# Altium schematic sheet WIRELESS_UART.SchDoc
size A4
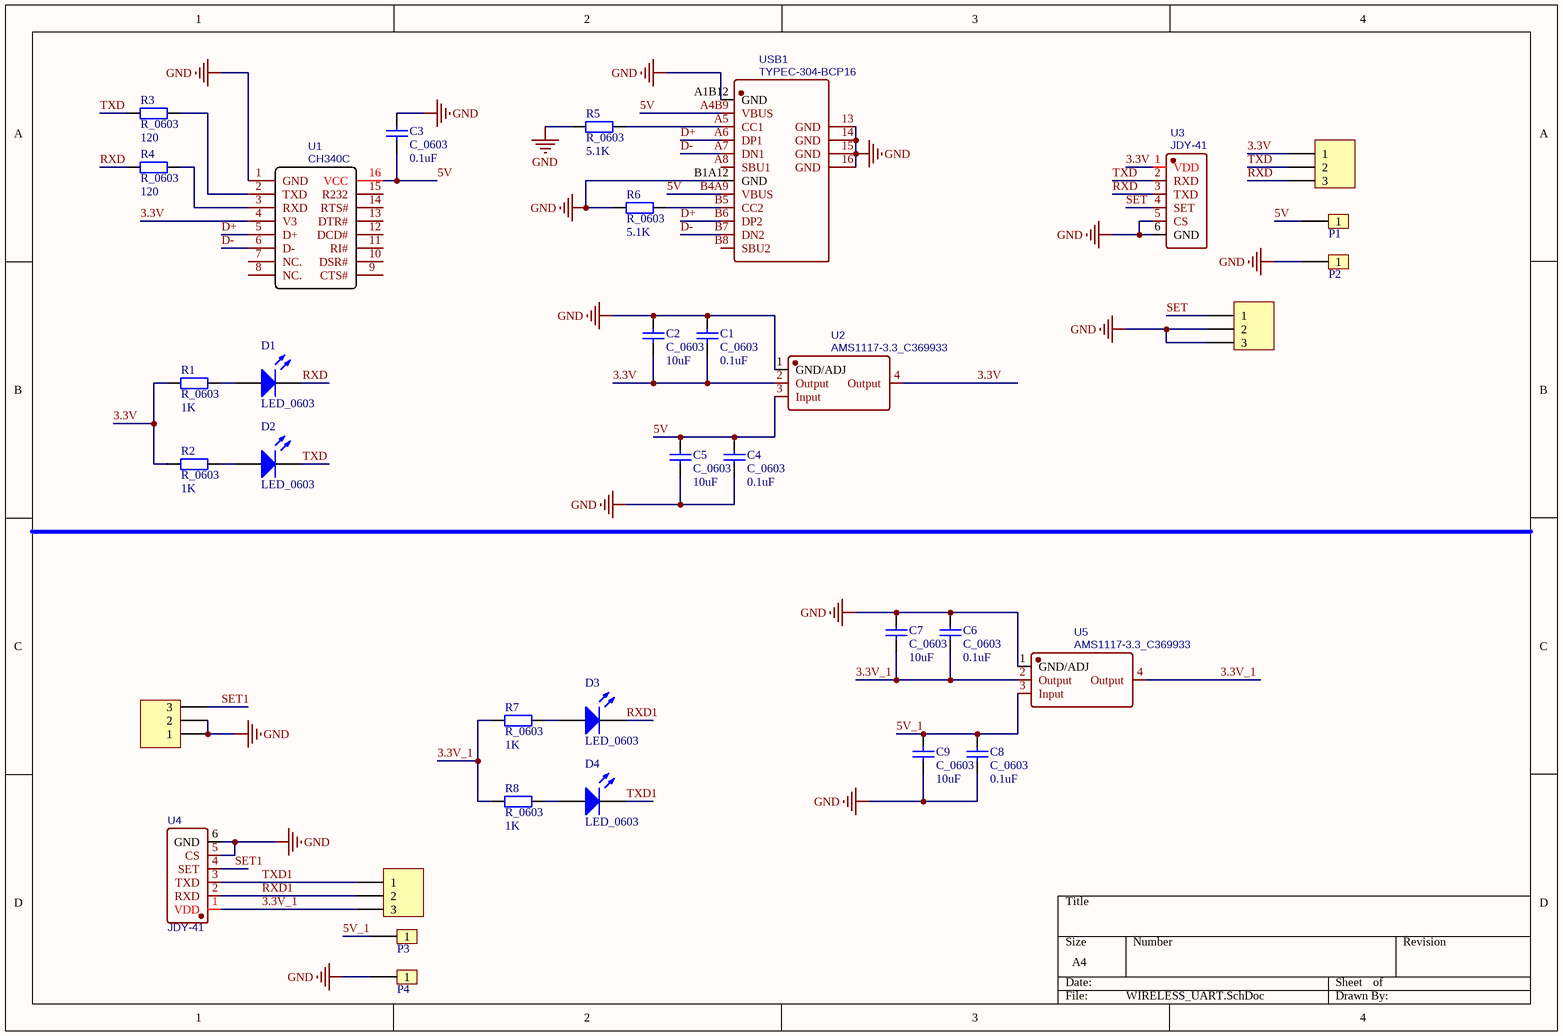
[diagram p0: WIRELESS_UART.SchDoc]

## Parts
C1  C_0603  value 0.1uF  [C_0603]
C2  C_0603  value 10uF  [C1206 - duplicate]
C3  C_0603  value 0.1uF  [C_0603]
C4  C_0603  value 0.1uF  [C_0603]
C5  C_0603  value 10uF  [C1206 - duplicate]
C6  C_0603  value 0.1uF  [C_0603]
C7  C_0603  value 10uF  [C1206 - duplicate]
C8  C_0603  value 0.1uF  [C_0603]
C9  C_0603  value 10uF  [C1206 - duplicate]
D1  LED_0603  [LED-0603]
D2  LED_0603  [LED-0603]
D3  LED_0603  [LED-0603]
D4  LED_0603  [LED-0603]
P1  Header 1  [HEADER1]  (value not drawn)
P2  Header 1  [HEADER1]  (value not drawn)
P3  Header 1  [HEADER1]  (value not drawn)
P4  Header 1  [HEADER1]  (value not drawn)
R1  R_0603  value 1K  [R_0603]
R2  R_0603  value 1K  [R_0603]
R3  R_0603  value 120  [R_0603]
R4  R_0603  value 120  [R_0603]
R5  R_0603  value 5.1K  [R_0603]
R6  R_0603  value 5.1K  [R_0603]
R7  R_0603  value 1K  [R_0603]
R8  R_0603  value 1K  [R_0603]
SWD1  SWD  [SH1_0X5P_WT]  (value not drawn)
SWD2  SWD  [SH1_0X5P_WT]  (value not drawn)
SWD3  SWD4  [SH1_0X5P_WT]  (value not drawn)
SWD4  SWD  [SH1_0X5P_WT]  (value not drawn)
U1  CH340C  [CH340C]
U2  AMS1117-3.3_C369933  [AMS1117]
U3  JDY-41  [2.4GMODLE]
U4  JDY-41  [2.4GMODLE]
U5  AMS1117-3.3_C369933  [AMS1117]
USB1  TYPEC-304-BCP16  [TYPE_C]

## Nets
GND: C1.2 C2.2 C3.2 C4.1 C5.1 C6.2 C7.2 C8.1 C9.1 P2.1 P4.1 R5.1 R6.2 SWD2.2 SWD2.3 SWD3.1 SWD3.2 U1.1(GND) U2.1(GND/ADJ) U3.5(CS) U3.6(GND) U4.5(CS) U4.6(GND) U5.1(GND/ADJ) USB1.13(GND) USB1.14(GND) USB1.15(GND) USB1.16(GND) USB1.A1B12(GND) USB1.B1A12(GND)
3.3V: C1.1 C2.1 R1.1 R2.1 SWD1.1 U1.4(V3) U2.2(Output) U2.4(Output) U3.1(VDD)
3.3V_1: C6.1 C7.1 R7.1 R8.1 SWD4.3 U4.1(VDD) U5.2(Output) U5.4(Output)
5V: C3.1 C4.2 C5.2 P1.1 U1.16(VCC) U2.3(Input) USB1.A4B9(VBUS) USB1.B4A9(VBUS)
5V_1: C8.2 C9.2 P3.1 U5.3(Input)
D+: U1.5(D+) USB1.A6(DP1) USB1.B6(DP2)
D-: U1.6(D-) USB1.A7(DN1) USB1.B7(DN2)
RXD: D1.2 R4.1 SWD1.3 U3.3(TXD)
RXD1: D3.2 SWD4.2 U4.2(RXD)
SET: SWD2.1 U3.4(SET)
SET1: SWD3.3 U4.4(SET)
TXD: D2.2 R3.1 SWD1.2 U3.2(RXD)
TXD1: D4.2 SWD4.1 U4.3(TXD)
NetD1_1: D1.1 R1.2
NetD2_1: D2.1 R2.2
NetD3_1: D3.1 R7.2
NetD4_1: D4.1 R8.2
NetR3_2: R3.2 U1.2(TXD)
NetR4_2: R4.2 U1.3(RXD)
NetR5_2: R5.2 USB1.A5(CC1)
NetR6_1: R6.1 USB1.B5(CC2)

Not connected (* = marked no-connect by the designer): U1 7(NC.) 8(NC.) 9(CTS#) 10(DSR#) 11(RI#) 12(DCD#) 13(DTR#) 14(RTS#) 15(R232); USB1 A8(SBU1) B8(SBU2)

## Library data of the parts
D1-D4 = LED 0603: 发光二极管; Published: 8-Jun-2000; LatestRevisionDate: 08-Jul-2005; LatestRevisionNote: Mech Layer 1 removed.; PackageReference: LED-0; Publisher: Altium Limited; PackageDescription: LED; 2 Leads
SWD1-SWD4 = SWD: SWD下载; LatestRevisionDate: 17-Jul-2002; LatestRevisionNote: Re-released for DXP Platform.; Publisher: Altium Limited
U1 = CH340C: BOM_Manufacturer: WCH; BOM_Supplier: LCSC; BOM_Manufacturer Part: CH340C; BOM_Supplier Part: C84681; BOM_JLCPCB Part Class: Extended Part; spicePre: U; spiceSymbolName: CH340C
U2 U5 = AMS1117-3.3_C369933: BOM_Manufacturer: KEXIN; Contributor: LCSC; BOM_Supplier: LCSC; BOM_Supplier Part: C369933; BOM_Manufacturer Part: AMS1117-3.3; BOM_JLCPCB Part Class: Extended Part; spicePre: U; spiceSymbolName: AMS1117-3.3_C369933
U3 U4 = M-BK2461U: BOM_Manufacturer: DreamLNK(骏晔科技); Contributor: LCSC; BOM_Supplier: LCSC; BOM_Supplier Part: C2837202; BOM_Manufacturer Part: M-BK2461U; spicePre: U; spiceSymbolName: M-BK2461U
USB1 = TYPEC-304-BCP16: BOM_Manufacturer: XUNPU; Contributor: LCSC; BOM_Supplier: LCSC; BOM_Supplier Part: C720629; BOM_Manufacturer Part: TYPEC-304-BCP16; BOM_JLCPCB Part Class: Extended Part; spicePre: U; spiceSymbolName: TYPEC-304-BCP16
C1-C9 = C_0603: Published: 8-Jun-2000; LatestRevisionDate: 17-Jul-2002; LatestRevisionNote: Re-released for DXP Platform.; PackageReference: RAD-0.3; Publisher: Altium Limited; PackageDescription: Radial Cap, Thru-Hole; 2 Leads; 0.3 in Pin Spacing
P1-P4 = Header 1: LatestRevisionDate: 17-Jul-2002; LatestRevisionNote: Re-released for DXP Platform.; Publisher: Altium Limited
R1-R8 = R_0603: Published: 8-Jun-2000; LatestRevisionDate: 17-Jul-2002; LatestRevisionNote: Re-released for DXP Platform.; PackageReference: AXIAL-0.4; Publisher: Altium Limited; PackageDescription: Axial Device, Thru-Hole; 2 Leads; 0.4 in Pin Spacing